# EAGLE design R450E (EAGLE 6.6.0)
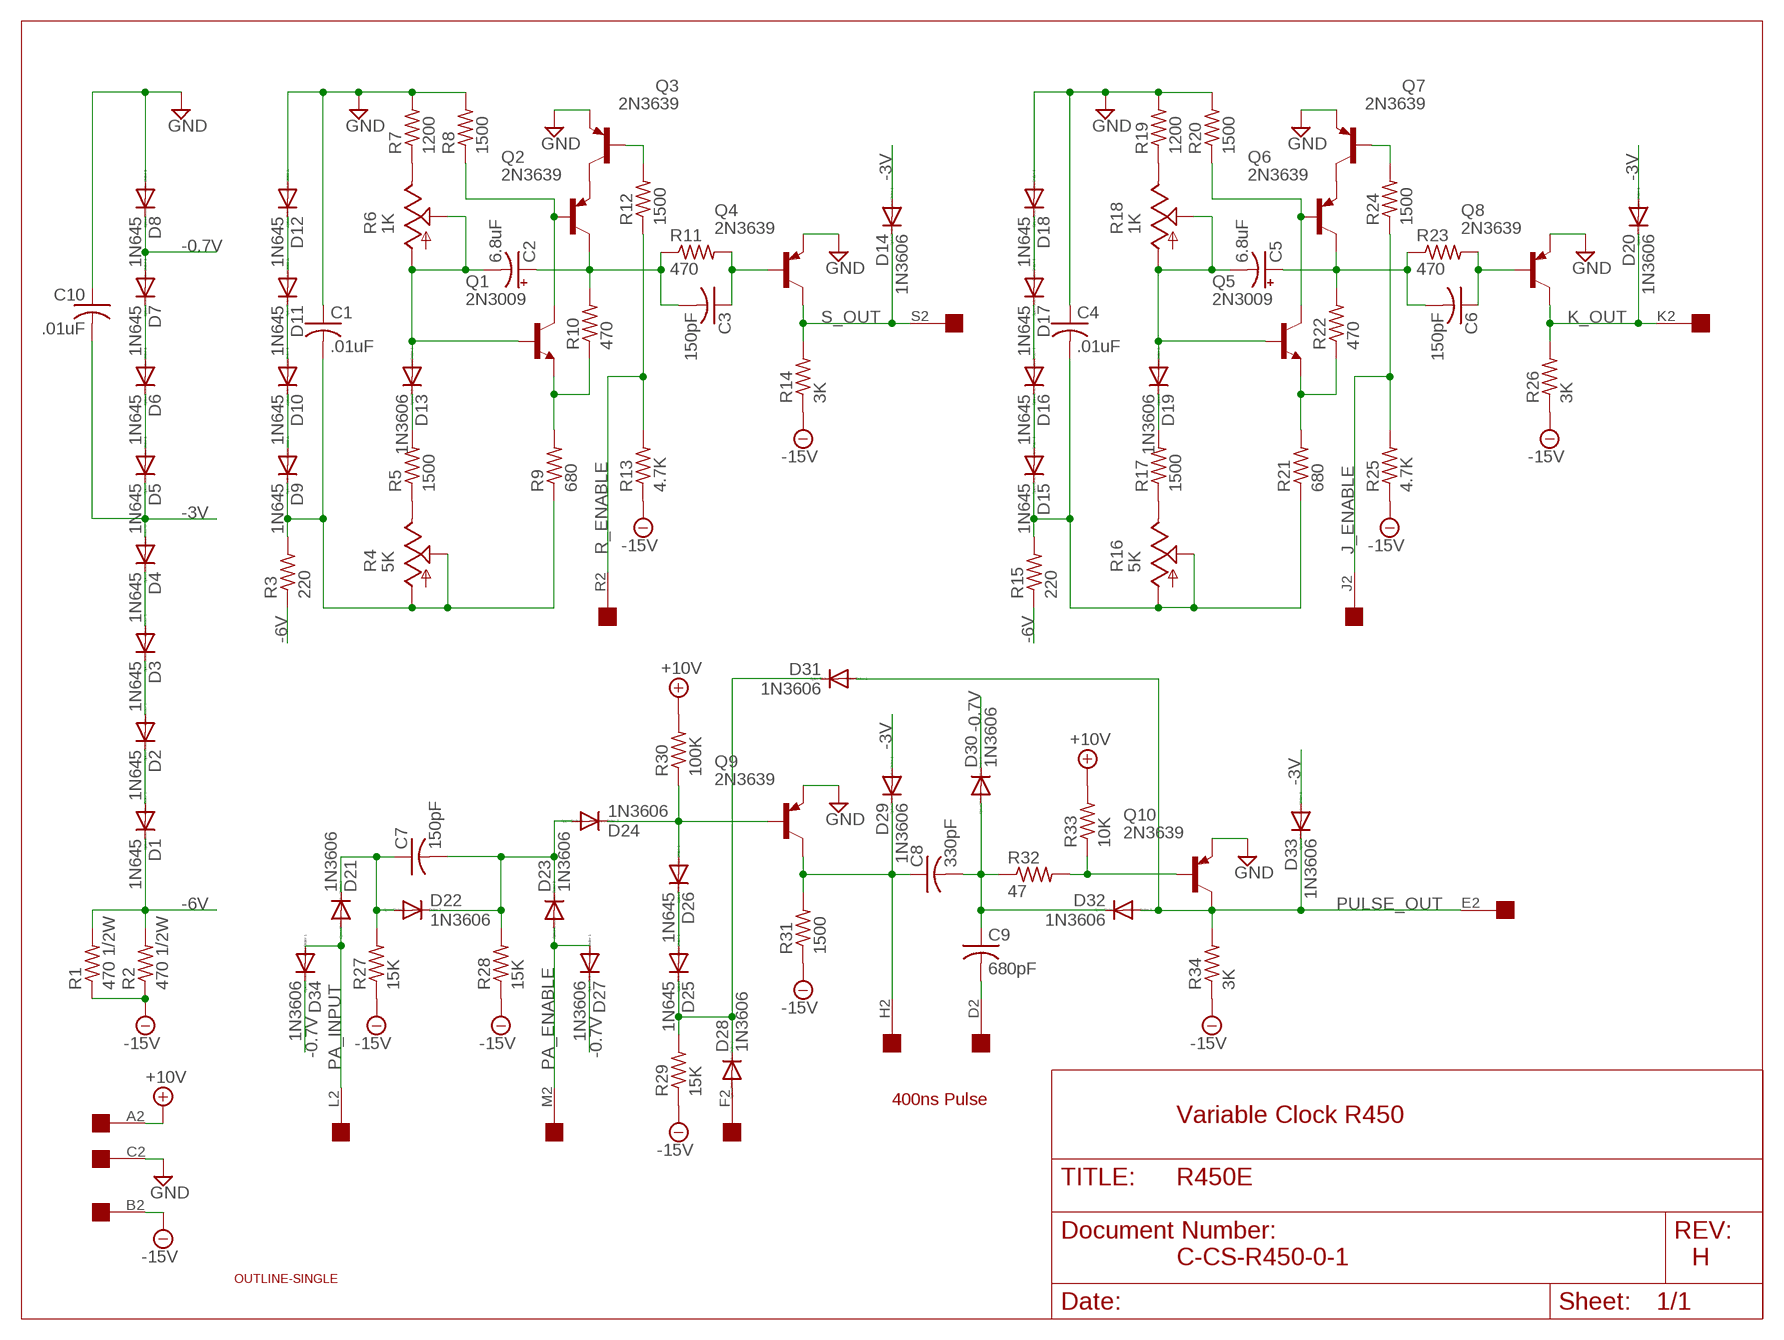
[diagram p0: schematic, sheet 1]

## Parts
C1  .01uF  C-US050-025X075  [C050-025X075]
C2  6.8uF  CPOL-USE12-4AXIAL  [E12-4]
C3  150pF  C-US075-032X103  [C075-032X103]
C4  .01uF  C-US050-025X075  [C050-025X075]
C5  6.8uF  CPOL-USE12-4AXIAL  [E12-4]
C6  150pF  C-US075-032X103  [C075-032X103]
C7  150pF  C-US075-032X103  [C075-032X103]
C8  330pF  C-US075-032X103  [C075-032X103]
C9  680pF  C-US075-032X103  [C075-032X103]
C10  .01uF  C-US050-025X075  [C050-025X075]
D1  1N645  1N4148DO35-10  [DO35-10]
D2  1N645  1N4148DO35-10  [DO35-10]
D3  1N645  1N4148DO35-10  [DO35-10]
D4  1N645  1N4148DO35-10  [DO35-10]
D5  1N645  1N4148DO35-10  [DO35-10]
D6  1N645  1N4148DO35-10  [DO35-10]
D7  1N645  1N4148DO35-10  [DO35-10]
D8  1N645  1N4148DO35-10  [DO35-10]
D9  1N645  1N4148DO35-10  [DO35-10]
D10  1N645  1N4148DO35-10  [DO35-10]
D11  1N645  1N4148DO35-10  [DO35-10]
D12  1N645  1N4148DO35-10  [DO35-10]
D13  1N3606  1N4148DO35-10  [DO35-10]
D14  1N3606  1N4148DO35-10  [DO35-10]
D15  1N645  1N4148DO35-10  [DO35-10]
D16  1N645  1N4148DO35-10  [DO35-10]
D17  1N645  1N4148DO35-10  [DO35-10]
D18  1N645  1N4148DO35-10  [DO35-10]
D19  1N3606  1N4148DO35-10  [DO35-10]
D20  1N3606  1N4148DO35-10  [DO35-10]
D21  1N3606  1N4148DO35-10  [DO35-10]
D22  1N3606  1N4148DO35-10  [DO35-10]
D23  1N3606  1N4148DO35-10  [DO35-10]
D24  1N3606  1N4148DO35-10  [DO35-10]
D25  1N645  1N4148DO35-10  [DO35-10]
D26  1N645  1N4148DO35-10  [DO35-10]
D27  1N3606  1N4148DO35-10  [DO35-10]
D28  1N3606  1N4148DO35-10  [DO35-10]
D29  1N3606  1N4148DO35-10  [DO35-10]
D30  1N3606  1N4148DO35-10  [DO35-10]
D31  1N3606  1N4148DO35-10  [DO35-10]
D32  1N3606  1N4148DO35-10  [DO35-10]
D33  1N3606  1N4148DO35-10  [DO35-10]
D34  1N3606  1N4148DO35-10  [DO35-10]
Q1  2N3009  2N2102  [TO5]
Q2  2N3639  2N2904  [TO39]
Q3  2N3639  2N2904  [TO39]
Q4  2N3639  2N2904  [TO39]
Q5  2N3009  2N2102  [TO5]
Q6  2N3639  2N2904  [TO39]
Q7  2N3639  2N2904  [TO39]
Q8  2N3639  2N2904  [TO39]
Q9  2N3639  2N2904  [TO39]
Q10  2N3639  2N2904  [TO39]
R1  470 1/2W  R-US_0411/15  [0411/15]
R2  470 1/2W  R-US_0411/15  [0411/15]
R3  220  R-US_0207/10  [0207/10]
R4  5K  TRIM_US-CT6  [CT6]
R5  1500  R-US_0207/10  [0207/10]
R6  1K  TRIM_US-CT6  [CT6]
R7  1200  R-US_0207/10  [0207/10]
R8  1500  R-US_0207/10  [0207/10]
R9  680  R-US_0207/10  [0207/10]
R10  470  R-US_0207/10  [0207/10]
R11  470  R-US_0207/10  [0207/10]
R12  1500  R-US_0207/10  [0207/10]
R13  4.7K  R-US_0207/10  [0207/10]
R14  3K  R-US_0207/10  [0207/10]
R15  220  R-US_0207/10  [0207/10]
R16  5K  TRIM_US-CT6  [CT6]
R17  1500  R-US_0207/10  [0207/10]
R18  1K  TRIM_US-CT6  [CT6]
R19  1200  R-US_0207/10  [0207/10]
R20  1500  R-US_0207/10  [0207/10]
R21  680  R-US_0207/10  [0207/10]
R22  470  R-US_0207/10  [0207/10]
R23  470  R-US_0207/10  [0207/10]
R24  1500  R-US_0207/10  [0207/10]
R25  4.7K  R-US_0207/10  [0207/10]
R26  3K  R-US_0207/10  [0207/10]
R27  15K  R-US_0207/10  [0207/10]
R28  15K  R-US_0207/10  [0207/10]
R29  15K  R-US_0207/10  [0207/10]
R30  100K  R-US_0207/10  [0207/10]
R31  1500  R-US_0207/10  [0207/10]
R32  47  R-US_0207/10  [0207/10]
R33  10K  R-US_0207/10  [0207/10]
R34  3K  R-US_0207/10  [0207/10]
U$1  OUTLINE-SINGLE  [SINGLE]
U$2  EDGE-1  [EDGE-CON1]

## Nets
+10V [Supply]: R30.2 R33.2 U$2.A2
-0.7V [Supply]: D7.A D8.C D27.C D30.C D34.C
-3V [Supply]: C10.2 D4.A D5.C D14.A D20.A D29.A D33.A
-6V [Supply]: D1.C R1.2 R2.2 R3.1 R15.1
-15V [Supply]: R1.1 R2.1 R13.1 R14.1 R25.1 R26.1 R27.1 R28.1 R29.1 R31.1 R34.1 U$2.B2
GND [Supply]: C1.1 C4.1 C10.1 D8.A D12.A D18.A Q3.1(E) Q4.1(E) Q7.1(E) Q8.1(E) Q9.1(E) Q10.1(E) R7.2 R8.2 R19.2 R20.2 U$2.C2
J_ENABLE: R24.1 R25.2 U$2.J2
K_OUT: D20.C Q8.3(C) R26.2 U$2.K2
N$1 [Supply]: D1.A D2.C
N$2 [Supply]: D5.A D6.C
N$3: D11.A D12.C
N$4: D10.A D11.C
N$5: D9.A D10.C
N$6 [Supply]: C1.2 D9.C R3.2 R4.A R4.S R9.1
N$7: Q1.1(E) R9.2 R10.1
N$8: R4.E R5.1
N$9: D13.C R5.2
N$10: C2.- D13.A Q1.2(B) R6.A R6.S
N$11: Q1.3(C) Q2.2(B) R8.1
N$12: C2.+ C3.2 Q2.3(C) R10.2 R11.1
N$13 [Supply]: D2.A D3.C
N$14 [Supply]: D3.A D4.C
N$15: Q3.2(B) R12.2
N$16: Q2.1(E) Q3.3(C)
N$17: R6.E R7.1
N$18: C3.1 Q4.2(B) R11.2
N$19: D17.A D18.C
N$20: D16.A D17.C
N$21: D15.A D16.C
N$22: C4.2 D15.C R15.2 R16.A R16.S R21.1
N$23: D19.C R17.2
N$24: D28.A U$2.F2
N$25: Q5.1(E) R21.2 R22.1
N$26: C7.1 D21.C D22.A R27.2
N$27: C5.- D19.A Q5.2(B) R18.A R18.S
N$28: C7.2 D22.C D23.C D24.A R28.2
N$29: Q5.3(C) Q6.2(B) R20.1
N$30: Q6.1(E) Q7.3(C)
N$32: R18.E R19.1
N$33: R16.E R17.1
N$34: C5.+ C6.2 Q6.3(C) R22.2 R23.1
N$35: C6.1 Q8.2(B) R23.2
N$36: Q7.2(B) R24.2
N$37: C8.1 D29.C Q9.3(C) R31.2 U$2.H2
N$39: D24.C D26.A Q9.2(B) R30.1
N$40: D25.A D26.C
N$41: D25.C D28.C D31.C R29.2
N$43: C8.2 C9.1 D30.A D32.C R32.1
N$44: C9.2 U$2.D2
N$45: Q10.2(B) R32.2 R33.1
N$47 [Supply]: D6.A D7.C
PA_ENABLE: D23.A D27.A U$2.M2
PA_INPUT: D21.A D34.A U$2.L2
PULSE_OUT: D31.A D32.A D33.C Q10.3(C) R34.2 U$2.E2
R_ENABLE: R12.1 R13.2 U$2.R2
S_OUT: D14.C Q4.3(C) R14.2 U$2.S2
Unconnected: U$2.N2 U$2.P2 U$2.T2 U$2.U2 U$2.V2

## Notes on the sheet
- 400ns Pulse
- Variable Clock R450
- C-CS-R450-0-1 | H

## Library data of the parts
C1 C3 C4 C6-C10 = rcl:C-US: CAPACITOR, American symbol
C2 C5 = dec-con:CPOL-USE12-4AXIAL: 0.5" veresion of an electrolytic
D1-D34 = diode:1N4148: DIODE high speed (Philips)
Q1 Q5 = transistor-npn:2N2102: NPN Transistor
Q2-Q4 Q6-Q10 = transistor-pnp:2N2904*: PNP Transistror
R1-R3 R5 R7-R15 R17 R19-R34 = rcl:R-US_: RESISTOR, American symbol
R4 R6 R16 R18 = pot:TRIM_US-: POTENTIOMETER
U$1 = dec-con:OUTLINE-*: Board outlines for DEC boards.
U$2 = dec-con:EDGE-1: Single-Sided DEC Edge Connector -- (side 2)

## Net classes
1 Supply: width 0.813 mm

## Board
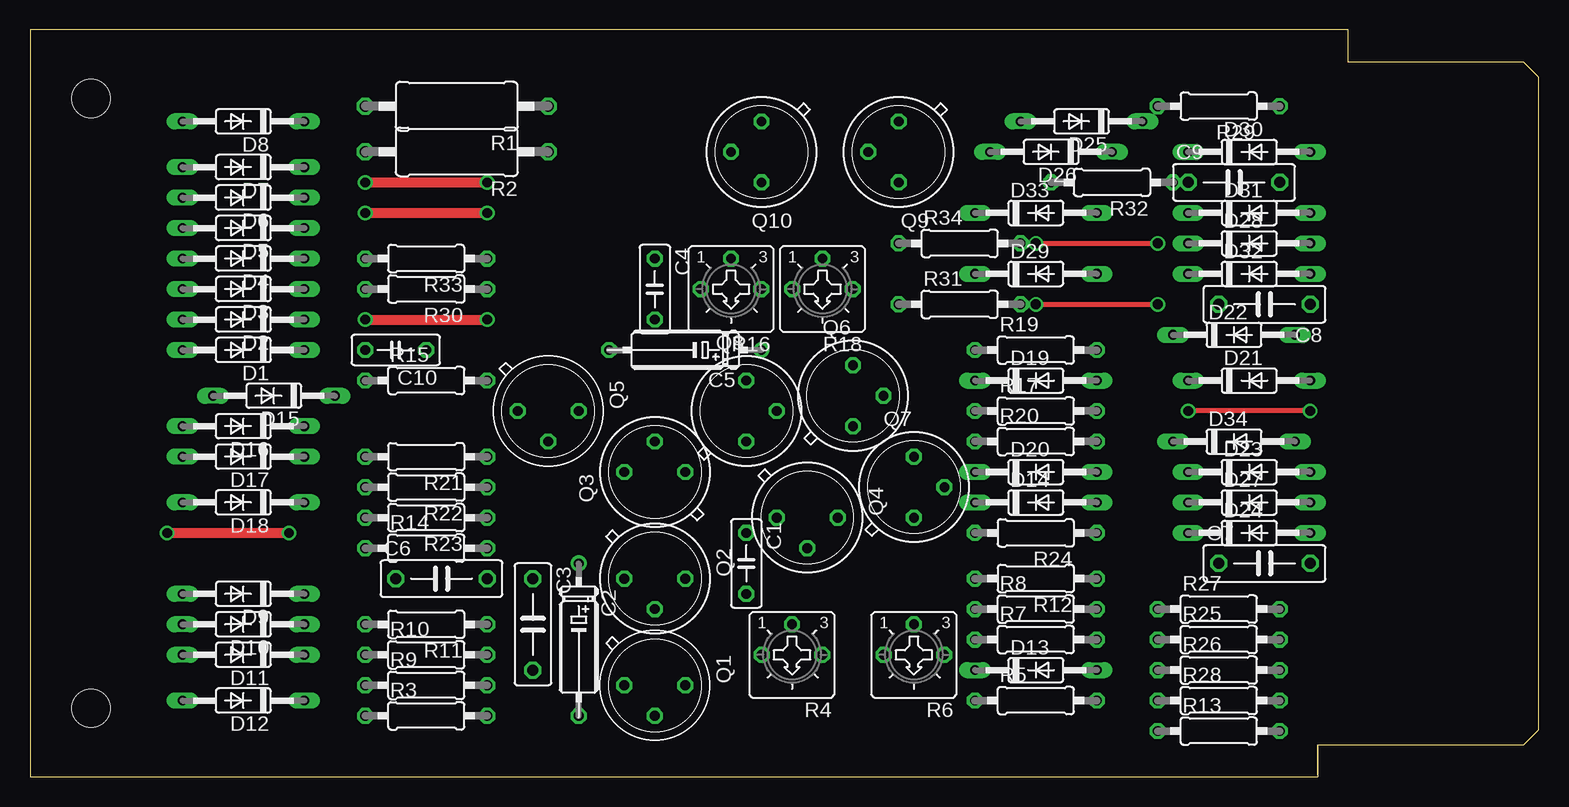
[diagram p1: board, top side]
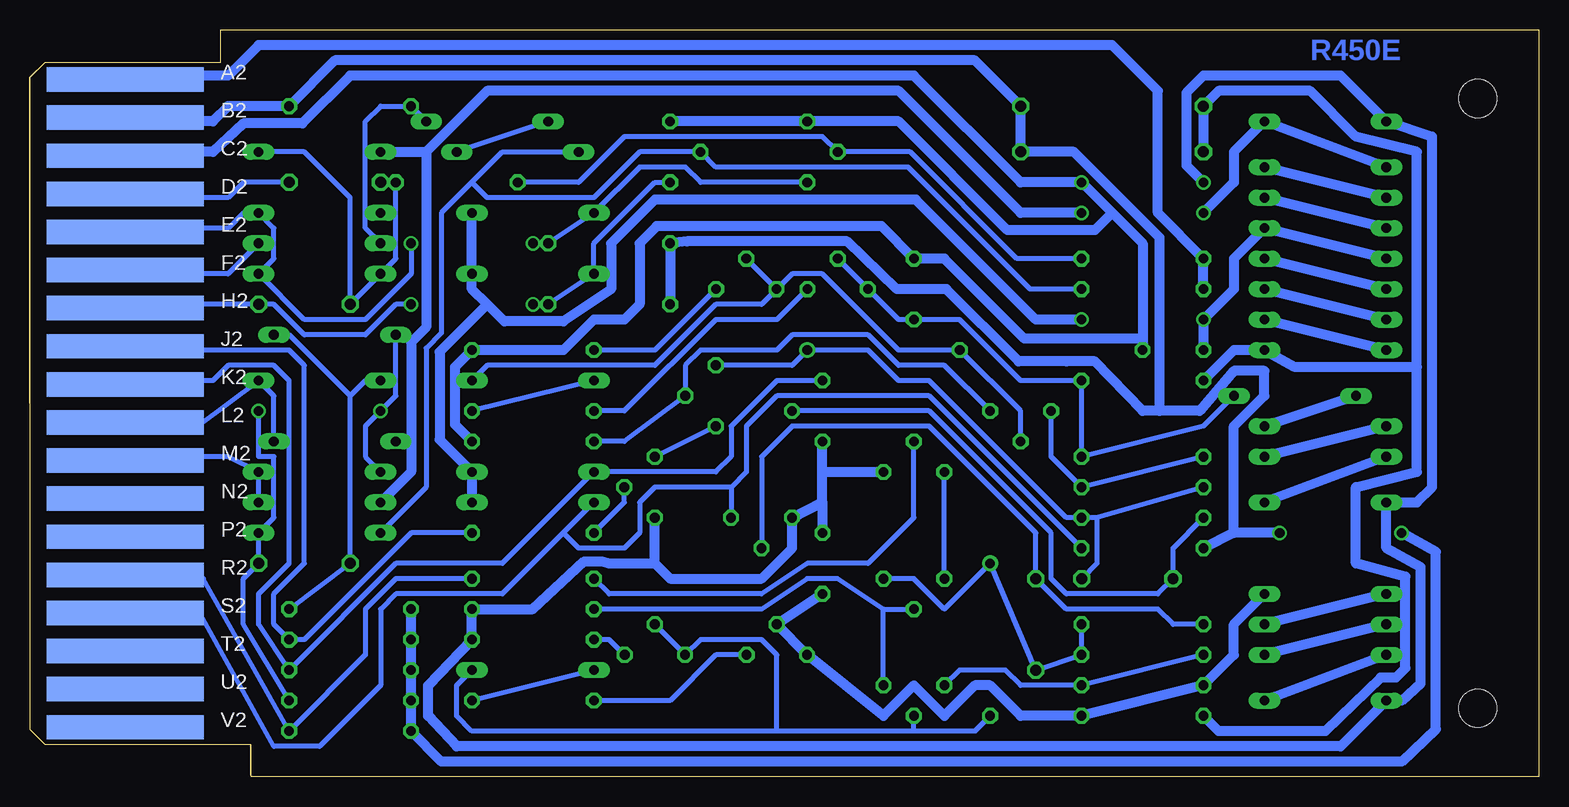
[diagram p2: board, bottom side, seen from below]

Size 125.73 x 62.23 mm. Coordinates in mm from the lower left corner, seen from the top.
Copper layers (1+16): Top 0.035mm / dielectric 1.5mm / Bottom 0.035mm
Design rules "16mils": minimum track width 16mil, minimum drill 32mil, track to track 15mil, track to pad 10mil, pad to pad 10mil, via to via 10mil, smd to smd 10mil, copper to edge 13mil, drill to drill 10mil, minimum pad ring 10mil, minimum via ring 8mil, stop-mask expansion 0mil, vias tented up to drill 0mil, thermal gap 10mil

### Footprints (pad centres in the part's own frame; a part is rotated, then mirrored left to right if it is on the bottom)
C050-025X075 = drill 0.813 octagon: 1 -2.54,0; 2 2.54,0
E12-4 = drill 0.813: + -7.62,0 | drill 0.813 octagon: - 5.08,0
C075-032X103 = drill 0.914 octagon: 1 -3.81,0; 2 3.81,0
DO35-10 = drill 0.813 long: A 5.08,0; C -5.08,0
TO5 = drill 0.813 octagon: 1 0,-2.54; 2 2.54,0; 3 0,2.54
TO39 = drill 0.813 octagon: 1 0,-2.54; 2 2.54,0; 3 0,2.54
0411/15 = drill 0.914 octagon: 1 -7.62,0; 2 7.62,0
0207/10 = drill 0.813 octagon: 1 -5.08,0; 2 5.08,0
CT6 = drill 0.813 octagon: A 2.515,0; E -2.515,0; S 0,-2.54
SINGLE = hole 3.175: 120.65,56.515; 120.65,5.715
EDGE-CON1 = smd 13.106 x 2.032 bottom: A2 7.938,4.128; B2 7.938,7.303; C2 7.938,10.477; D2 7.938,13.652; E2 7.938,16.828; F2 7.938,20.003; H2 7.938,23.177; J2 7.938,26.352; K2 7.938,29.527; L2 7.938,32.703; M2 7.938,35.877; N2 7.938,39.053; P2 7.938,42.227; R2 7.938,45.403; S2 7.938,48.578; T2 7.938,51.752; U2 7.938,54.928; V2 7.938,58.102

### Placement (x,y rotation side)
C1  59.69,17.78 270 top
C2  45.72,10.16 270 top
C3  41.91,12.7 270 top
C4  52.07,40.64 270 top
C5  53.34,35.56 180 top
C6  34.29,16.51 0 top
C7  102.87,17.78 0 top
C8  102.87,39.37 180 top
C9  100.33,49.53 0 top
C10  30.48,35.56 180 top
D1  17.78,35.56 180 top
D2  17.78,38.1 180 top
D3  17.78,40.64 180 top
D4  17.78,43.18 180 top
D5  17.78,45.72 180 top
D6  17.78,48.26 180 top
D7  17.78,50.8 180 top
D8  17.78,54.61 180 top
D9  17.78,15.24 180 top
D10  17.78,12.7 180 top
D11  17.78,10.16 180 top
D12  17.78,6.35 180 top
D13  83.82,8.89 0 top
D14  83.82,22.86 0 top
D15  20.32,31.75 180 top
D16  17.78,29.21 180 top
D17  17.78,26.67 180 top
D18  17.78,22.86 180 top
D19  83.82,33.02 0 top
D20  83.82,25.4 0 top
D21  101.6,33.02 0 top
D22  100.33,36.83 0 top
D23  101.6,25.4 0 top
D24  101.6,20.32 0 top
D25  87.63,54.61 180 top
D26  85.09,52.07 180 top
D27  101.6,22.86 0 top
D28  101.6,44.45 0 top
D29  83.82,41.91 0 top
D30  101.6,52.07 0 top
D31  101.6,46.99 0 top
D32  101.6,41.91 0 top
D33  83.82,46.99 0 top
D34  100.33,27.94 0 top
Q1  52.07,7.62 270 top
Q2  52.07,16.51 270 top
Q3  52.07,25.4 90 top
Q4  64.77,21.59 270 top
Q5  43.18,30.48 270 top
Q6  68.58,31.75 0 top
Q7  73.66,24.13 0 top
Q8  59.69,30.48 0 top
Q9  72.39,52.07 180 top
Q10  60.96,52.07 180 top
R1  35.56,55.88 180 top
R2  35.56,52.07 180 top
R3  33.02,5.08 0 top
R4  63.5,10.16 180 top
R5  83.82,6.35 0 top
R6  73.66,10.16 180 top
R7  83.82,11.43 0 top
R8  83.82,13.97 0 top
R9  33.02,7.62 0 top
R10  33.02,10.16 0 top
R11  33.02,12.7 180 top
R12  83.82,16.51 180 top
R13  99.06,3.81 0 top
R14  33.02,19.05 0 top
R15  33.02,33.02 0 top
R16  58.42,40.64 180 top
R17  83.82,30.48 0 top
R18  66.04,40.64 180 top
R19  83.82,35.56 0 top
R20  83.82,27.94 0 top
R21  33.02,26.67 180 top
R22  33.02,24.13 180 top
R23  33.02,21.59 180 top
R24  83.82,20.32 180 top
R25  99.06,11.43 0 top
R26  99.06,8.89 0 top
R27  99.06,13.97 0 top
R28  99.06,6.35 0 top
R29  99.06,55.88 180 top
R30  33.02,40.64 180 top
R31  77.47,39.37 0 top
R32  90.17,49.53 180 top
R33  33.02,43.18 180 top
R34  77.47,44.45 0 top
U$1  125.73,62.23 180 top
U$2  125.73,62.23 180 top

### Tracks (layer width: path | path; a pad name or v marks a point on that pad's centre or on a via)
+10V
  Bottom 0.813: U$2.A2 117.22,58.04 116.84,58.42 109.22,58.42 106.68,60.96 35.56,60.96 31.75,57.15 31.75,46.99 R33.2 R30.2
-0.7V  (via drill 0.81)
  Top 0.813: v27.94,46.99 v38.1,46.99
  Bottom 0.813: D7.A D8.C 25.4,52.07 25.4,49.53 v27.94,46.99 | v38.1,46.99 43.18,46.99 53.34,57.15 87.63,57.15 92.71,52.07 | D27.C 93.98,25.4 93.98,27.94 | 92.71,52.07 92.71,37.47 93.98,36.2 93.98,27.94 | D30.C 92.71,52.07 | D34.C 93.98,27.94
-3V  (via drill 0.81)
  Top 0.813: v27.94,38.1 v38.1,38.1
  Bottom 0.813: D4.A D5.C 25.4,43.18 25.4,40.64 v27.94,38.1 C10.2 | D14.A D20.A 91.6,28.1 91.6,35.4 87.63,39.37 | v38.1,38.1 41.91,38.1 51.91,48.1 73.66,48.1 77.31,44.45 77.31,40.64 | 77.31,40.64 | 77.31,40.64 81.28,37.94 86.2,37.94 87.63,39.37 | 87.63,39.37 88.9,40.64 D29.A D33.A
-6V
  Bottom 0.813: R2.2 R1.2 26.67,57.15 19.05,57.15 15.24,53.34 10.16,52.07 10.16,34.13 | 10.16,34.13 20.32,34.13 D1.C 25.4,35.56 R15.1 | R3.1 26.67,3.81 17.78,3.81 13.18,8.26 11.91,8.26 11.11,9.05 11.11,16.67 15.24,17.78 15.24,24.13 10.16,25.4 10.16,34.13
-15V  (via drill 0.81)
  Top 0.813: v11.43,20.32 v21.59,20.32
  Bottom 0.813: U$2.B2 117.13,54.9 116.84,54.61 110.49,54.61 109.22,55.88 R29.1 100.33,59.69 46.99,59.69 R1.1 R2.1 38.73,52.07 31.59,44.93 31.59,30.48 | R27.1 R25.1 R26.1 R28.1 R13.1 91.44,1.27 11.43,1.27 8.57,3.97 8.57,18.73 v11.43,20.32 | v21.59,20.32 25.4,20.32 | 25.4,20.32 R14.1 | R31.1 R34.1 70.96,44.61 57.63,44.61 53.5,40.64 49.37,40.64 43.34,34.61 39.37,34.61 36.99,34.61 33.02,30.48 31.59,30.48 | 25.4,20.32 25.4,29.21 22.86,31.75 22.86,33.81 25.4,33.81 28.26,30.48 31.59,30.48
GND  (via drill 0.81)
  Top 0.813: v27.94,49.53 v38.1,49.53
  Bottom 0.813: v27.94,49.53 29.37,50.96 29.37,56.99 27.94,58.42 16.51,58.42 D8.A 8.89,53.34 8.89,24.13 10.16,22.86 D18.A 12.7,19.05 9.84,17.46 9.84,7.78 11.43,6.35 D12.A 16.51,2.54 90.17,2.54 92.55,5.08 92.55,7.62 R7.2 R8.2 83.82,13.97 79.53,17.94 78.11,17.94 77.47,17.78 73.66,17.78 | 35.56,46.99 33.02,44.45 33.02,36.51 | 35.56,46.99 v38.1,49.53 43.18,49.53 52.07,58.42 99.06,58.42 103.03,54.45 107.95,54.45 110.49,52.07 116.84,52.07 U$2.C2 | 59.69,25.4 Q3.1 | 59.69,22.86 Q4.1 62.23,19.05 64.77,16.51 72.39,16.51 73.66,17.78 | 73.66,17.78 Q7.1 | 59.69,22.86 C1.1 | 59.69,22.86 59.69,25.4 | 59.69,25.4 Q8.1 | Q9.1 Q10.1 53.34,54.61 44.29,45.56 36.99,45.56 35.56,46.99 | 33.02,36.51 C10.1 | 33.02,36.51 42.86,36.51 49.53,43.18 C4.1 54.77,45.88 73.5,45.88 74.93,44.45 74.93,39.37 76.2,38.1 78.74,38.1 81.28,35.56 R19.2 90.33,34.13 90.33,29.37 R20.2
J_ENABLE
  Bottom 0.406: U$2.J2 117.17,35.89 116.84,35.56 104.14,35.56 102.87,34.29 102.87,17.78 105.41,15.24 105.41,12.7 R25.2 102.87,11.43 93.98,20.32 R24.1
K_OUT
  Bottom 0.406: U$2.K2 117.14,32.72 116.84,33.02 110.49,33.02 109.22,34.29 105.41,34.29 104.14,33.02 104.14,17.78 106.68,15.24 106.68,12.7 R26.2 95.25,17.78 86.36,17.78 D20.C 68.58,25.4 67.31,26.67 67.31,29.21 63.5,33.02 Q8.3
N$1
  Bottom 0.813: D1.A D2.C
N$2
  Bottom 0.813: D5.A D6.C
N$3
  Bottom 0.813: D11.A D12.C
N$4
  Bottom 0.813: D10.A D11.C
N$5
  Bottom 0.813: D9.A D10.C
N$6
  Bottom 0.813: D9.C 25.4,12.7 25.4,10.16 R9.1 R3.2 43.18,5.08 45.72,7.62 46.99,7.62 49.53,5.08 52.07,7.62 54.61,5.08 60.96,10.16 R4.A 60.98,10.19 R4.S C1.2
N$7
  Bottom 0.406: R10.1 R9.2 43.18,7.62 44.45,8.89 48.26,8.89 Q1.1
N$8
  Bottom 0.406: R4.E 68.58,10.16 72.39,6.35 R5.1
N$9
  Bottom 0.406: D13.C R5.2
N$10
  Bottom 0.406: D13.A 90.17,7.62 90.17,5.08 88.9,3.81 63.5,3.81 | 71.12,10.16 69.85,11.43 64.77,11.43 63.5,10.16 63.5,3.81 | C2.- 46.99,3.81 52.07,3.81 | 52.07,3.81 Q1.2 | 52.07,3.81 63.5,3.81 | 71.12,10.16 R6.A | 71.12,10.16 R6.S
N$11
  Bottom 0.406: R8.1 64.77,13.97 60.96,16.51 58.42,16.51 54.61,13.97 | Q1.3 54.61,13.97 | 54.61,13.97 Q2.2
N$12
  Bottom 0.406: Q2.3 52.07,16.51 49.53,13.97 C2.+ C3.2 R10.2 R11.1
N$13
  Bottom 0.813: D2.A D3.C
N$14
  Bottom 0.813: D3.A D4.C
N$15
  Bottom 0.406: R12.2 77.47,15.24 64.77,15.24 60.96,17.78 55.88,17.78 52.07,21.59 Q3.2
N$16
  Bottom 0.406: Q2.1 Q3.3
N$17
  Bottom 0.406: R6.E 76.2,10.16 77.47,11.43 R7.1
N$18
  Bottom 0.406: R11.2 30.48,12.7 31.75,13.97 39.37,13.97 C3.1 41.91,20.32 50.8,29.21 62.23,29.21 64.77,26.67 Q4.2
N$19
  Bottom 0.813: D17.A D18.C
N$20
  Bottom 0.813: D16.A D17.C
N$21
  Bottom 0.813: D15.A D16.C
N$22
  Bottom 0.406: D15.C 27.94,29.21 R21.1 R15.2 43.18,33.02 48.26,38.1 C4.2 53.34,38.1 55.88,40.64 | 55.88,40.64 R16.A | 55.88,40.64 R16.S
N$23
  Bottom 0.406: D19.C R17.2
N$24
  Bottom 0.406: U$2.F2 117.81,41.91 109.22,41.91 D28.A
N$25
  Bottom 0.406: R21.2 R22.1 40.64,26.67 Q5.1
N$26
  Bottom 0.406: 99.06,31.75 97.79,33.02 D21.C | 99.06,31.75 C7.1 R27.2 | D22.A 104.14,36.83 99.06,31.75
N$27
  Bottom 0.406: Q5.2 43.18,30.48 C5.- 53.34,35.56 59.69,41.91 62.23,41.91 63.5,40.64 | 63.5,40.64 R18.S | D19.A 87.63,34.29 73.66,34.29 68.58,39.37 64.77,39.37 63.5,40.64 | 63.5,40.64 R18.A
N$28  (via drill 0.81)
  Top 0.406: v106.68,30.48 v96.52,30.48
  Bottom 0.406: D23.C 97.79,26.67 97.79,29.21 v96.52,30.48 95.25,31.75 D22.C | v106.68,30.48 106.68,26.67 105.41,26.67 105.41,21.59 D24.A C7.2 107.95,16.51 107.95,12.7 R28.2
N$29
  Bottom 0.406: Q5.3 49.53,34.29 53.34,34.29 55.88,36.83 62.23,36.83 63.5,35.56 69.85,35.56 71.12,34.29 Q6.2 76.2,27.94 R20.1
N$30
  Bottom 0.406: Q6.1 Q7.3
N$32
  Bottom 0.406: R18.E 68.58,40.64 73.66,35.56 R19.1
N$33
  Bottom 0.406: R16.E 60.96,40.64 63.5,38.1 68.58,38.1 76.2,30.48 R17.1
N$34
  Bottom 0.406: Q6.3 62.23,34.29 C5.+ 55.88,35.56 53.34,33.02 50.8,33.02 39.37,21.59 R23.1 36.83,21.59 | C6.2 36.83,17.78 36.83,21.59 | R22.2 36.83,21.59
N$35
  Bottom 0.406: R23.2 30.48,19.05 C6.1 31.75,15.24 39.37,15.24 40.64,16.51 40.64,20.32 50.8,30.48 Q8.2
N$36
  Bottom 0.406: Q7.2 76.2,22.86 R24.2
N$37  (via drill 0.81)
  Top 0.406: v83.82,39.37 v93.98,39.37
  Bottom 0.406: U$2.H2 117.76,39.37 C8.1 105.41,39.37 102.87,36.83 97.79,36.83 95.25,39.37 v93.98,39.37 | Q9.3 73.66,49.53 78.74,44.45 D29.C R31.2 v83.82,39.37
N$39
  Bottom 0.406: D24.C 92.71,24.13 92.71,35.72 91.44,36.99 91.44,46.99 88.9,49.53 | 88.9,49.53 86.36,52.07 D26.A | R30.1 42.39,40.64 52.55,50.8 68.58,50.8 Q9.2 74.93,52.07 78.74,48.26 87.63,48.26 88.9,49.53
N$40
  Bottom 0.406: D25.A D26.C
N$41
  Bottom 0.406: 97.79,46.99 97.79,54.61 96.52,55.88 R29.2 D25.C | 97.79,46.99 97.79,45.72 D28.C | 97.79,46.99 D31.C
N$43
  Bottom 0.406: D30.A 102.87,52.07 99.06,48.26 C8.2 D32.C 95.25,43.18 R32.1 C9.1
N$44
  Bottom 0.406: U$2.D2 117.73,48.26 109.22,48.26 107.95,49.53 C9.2
N$45
  Bottom 0.406: R33.1 43.5,43.18 52.39,52.07 Q10.2 59.69,53.34 76.2,53.34 80.01,49.53 R32.2
N$47
  Bottom 0.813: D6.A D7.C
PA_ENABLE
  Bottom 0.406: U$2.M2 116.84,26.67 109.22,26.67 D23.A D27.A
PA_INPUT
  Bottom 0.406: U$2.L2 117.17,29.54 116.84,29.21 111.76,29.21 D21.A 105.41,31.75 D34.A
PULSE_OUT  (via drill 0.81)
  Top 0.406: v83.82,44.45 v93.98,44.45
  Bottom 0.406: U$2.E2 117.71,45.72 109.22,45.72 107.95,46.99 D31.A 105.41,45.72 105.41,43.18 D32.A 102.87,38.1 97.79,38.1 93.98,41.91 v93.98,44.45 | Q10.3 69.85,49.53 71.12,50.8 74.93,50.8 D33.C R34.2 v83.82,44.45
R_ENABLE
  Bottom 0.406: U$2.R2 115.9,16.84 115.57,16.51 111.28,16.51 R13.2 97.79,10.16 97.79,13.97 95.25,16.51 R12.1
S_OUT
  Bottom 0.406: U$2.S2 117.73,13.97 111.76,13.97 105.41,2.54 101.6,2.54 96.52,7.62 96.52,13.97 95.25,15.24 86.36,15.24 81.28,20.32 | 81.28,20.32 D14.C | 67.31,24.13 Q4.3 | 67.31,24.13 73.66,24.13 74.93,22.86 74.93,20.32 76.2,19.05 80.01,19.05 81.28,20.32 | R14.2 50.8,31.75 63.5,31.75 66.04,29.21 66.04,25.4 67.31,24.13

### Text on the board
Bottom: R450E
200bmp: C:/Users/Vince/Documents/websvn/trunk/Eagle/projects/DEC/Rxxx/R450/R450Ebackfb.bmp